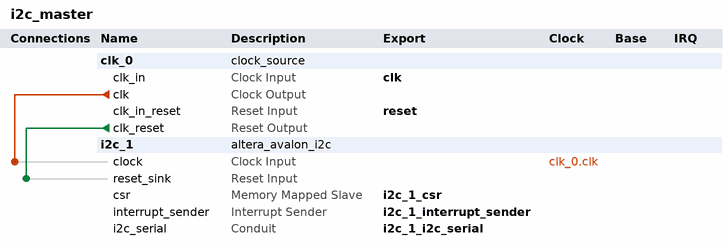
[diagram p0: system contents]
# Platform Designer (Qsys) system i2c_master, MAX 10 10M08DCU324C8G
# Parameters at their usual value, and those the tool derives, are not listed.
package require -exact qsys 16.1
create_system i2c_master
set_project_property DEVICE_FAMILY {MAX 10}
set_project_property DEVICE 10M08DCU324C8G

add_instance clk_0 clock_source 16.1
set_instance_parameter_value clk_0 clockFrequency 50000000

add_instance i2c_1 altera_avalon_i2c 16.1
set_instance_parameter_value i2c_1 FIFO_DEPTH 32

# connections
add_connection clk_0.clk i2c_1.clock clock
add_connection clk_0.clk_reset i2c_1.reset_sink reset

# exported interfaces
add_interface clk clock sink
set_interface_property clk EXPORT_OF clk_0.clk_in
add_interface i2c_1_csr avalon slave
set_interface_property i2c_1_csr EXPORT_OF i2c_1.csr
add_interface i2c_1_i2c_serial conduit end
set_interface_property i2c_1_i2c_serial EXPORT_OF i2c_1.i2c_serial
add_interface i2c_1_interrupt_sender interrupt sender
set_interface_property i2c_1_interrupt_sender EXPORT_OF i2c_1.interrupt_sender
add_interface reset reset sink
set_interface_property reset EXPORT_OF clk_0.clk_in_reset

set_interconnect_requirement {$system} qsys_mm.clockCrossingAdapter HANDSHAKE
set_interconnect_requirement {$system} qsys_mm.enableEccProtection FALSE
set_interconnect_requirement {$system} qsys_mm.insertDefaultSlave FALSE
set_interconnect_requirement {$system} qsys_mm.maxAdditionalLatency 1

save_system i2c_master.qsys
